# Altium schematic sheet BV100011_ControlDEBUG.SchDoc
size A4
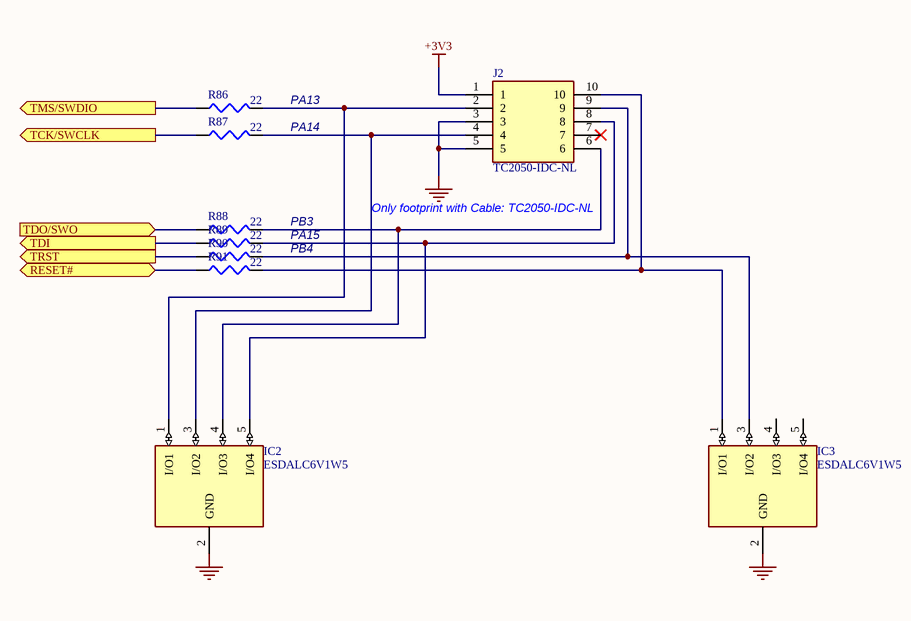
[diagram p0: BV100011_ControlDEBUG.SchDoc]

## Parts
IC2  ESDALC6V1W5  [SOT65P210X110-5N]
IC3  ESDALC6V1W5  [SOT65P210X110-5N]
J2  TC2050-IDC-NL  [CON_TAG-C_TC2050-IDC-NL]
R86  22  [J1-0603]
R87  22  [J1-0603]
R88  22  [J1-0603]
R89  22  [J1-0603]
R90  22  [J1-0603]
R91  22  [J1-0603]

## Ports
RESET# (bidir), TCK/SWCLK (out), TDI (out), TDO/SWO (in), TMS/SWDIO (out), TRST (out)

## Nets
+3V3: J2.1
GND: IC2.2(GND) IC3.2(GND) J2.3 J2.5
RESET#: R91.1 ; port RESET#
TCK/SWCLK: R87.1 ; port TCK/SWCLK
TDI: R89.1 ; port TDI
TDO/SWO: R88.1 ; port TDO/SWO
TMS/SWDIO: R86.1 ; port TMS/SWDIO
TRST: R90.1 ; port TRST
NetIC2_1: IC2.1(I/O1) J2.2 R86.2
NetIC2_3: IC2.3(I/O2) J2.4 R87.2
NetIC2_4: IC2.4(I/O3) J2.6 R88.2
NetIC2_5: IC2.5(I/O4) J2.8 R89.2
NetIC3_1: IC3.1(I/O1) J2.10 R91.2
NetIC3_3: IC3.3(I/O2) J2.9 R90.2

Not connected (* = marked no-connect by the designer): IC3 4(I/O3) 5(I/O4); J2 7*

## Notes on the sheet
- PA13
- PA14
- PB3
- PA15
- PB4
- Only footprint with Cable: TC2050-IDC-NL

## Library data of the parts
IC2 IC3 = ESDALC6V1W5: Integrated Circuit; Manufacturer_Name: STMicroelectronics; Allied_Number: 70389952; Datasheet Link: http://www.st.com/web/en/resource/technical/document/datasheet/CD00002946.pdf; Height: 1.1mm; Manufacturer_Part_Number: ESDALC6V1W5; Mouser Part Number: 511-ESDALC6V1W5; Mouser Price/Stock: https://www.mouser.com/Search/Refine.aspx?Keyword=511-ESDALC6V1W5; RS Part Number: 0250044P; RS Price/Stock: http://uk.rs-online.com/web/p/products/0250044P; Allied Price/Stock: http://www.alliedelec.com/stmicroelectronics-esdalc6v1w5/70389952/
J2 = TC2050-IDC-NL: Plug-Of-Nailsâ„¢ Adapter Cable; MF: Tag-Connect LLC; MP: TC2050-IDC-NL; Availability: Unavailable; Package: None; Value: *; Price: None; SnapEDA_Link: https://www.snapeda.com/parts/TC2050-IDC-NL/Tag-Connect%20LLC/view-part/134534/?ref=snap
R86-R91 = Res3: Resistor; Published: 8-Jun-2000; LatestRevisionDate: 29-May-2009; LatestRevisionNote: IPC-7351 Footprint Added.; PackageReference: J1-0603; Publisher: Altium Limited; PackageDescription: Chip Resistor; Value: 22